# EAGLE design umoto (EAGLE 5.12)
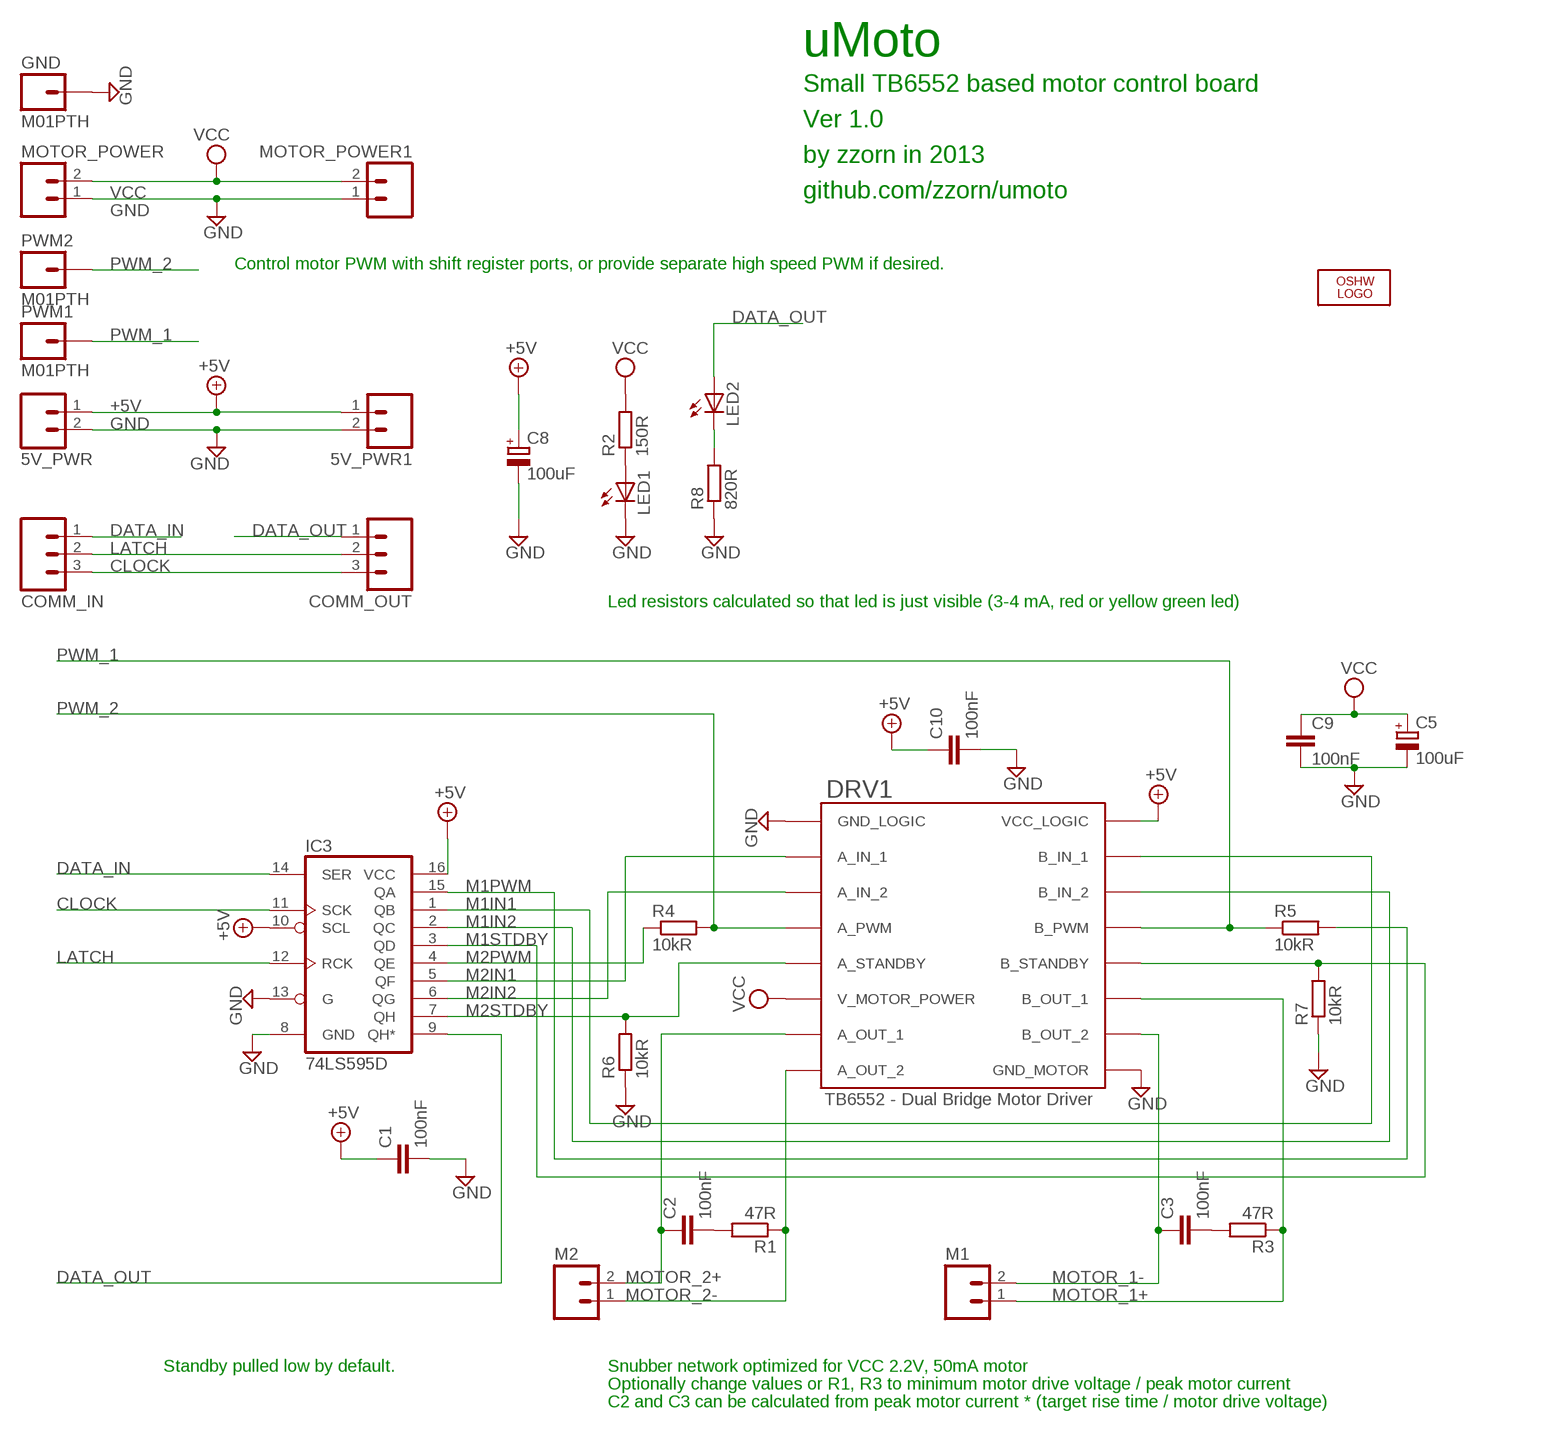
[diagram p0: schematic, sheet 1]

## Parts
5V_PWR  M02PTH  [1X02]
5V_PWR1  M02PTH  [1X02]
C1  100nF  C-EUC0805  [C0805]
C2  100nF  C-EUC0805  [C0805]
C3  100nF  C-EUC0805  [C0805]
C5  100uF  CPOL-EUE2.5-6  [E2,5-6]
C8  100uF  CPOL-EUE2.5-6  [E2,5-6]
C9  100nF  C-EUC0805  [C0805]
C10  100nF  C-EUC0805  [C0805]
COMM_IN  M03PTH  [1X03]
COMM_OUT  M03PTH  [1X03]
DRV1  TB6552FN  [SSOP16]
GND  M01PTH  [1X01]
IC3  74LS595D  [SO16]
LED1  LEDCHIPLED_0805  [CHIPLED_0805]
LED2  LEDCHIPLED_0805  [CHIPLED_0805]
LOGO1  OSHW_LOGO_6MILX0070-NT  [OSHW_6X70_NOTEXT]
M1  M02PTH  [1X02]
M2  M02PTH  [1X02]
MOTOR_POWER  M02PTH  [1X02]
MOTOR_POWER1  M02PTH  [1X02]
PWM1  M01PTH  [1X01]
PWM2  M01PTH  [1X01]
R1  47R  R-EU_R0805  [R0805]
R2  150R  R-EU_R0805  [R0805]
R3  47R  R-EU_R0805  [R0805]
R4  10kR  R-EU_R0805  [R0805]
R5  10kR  R-EU_R0805  [R0805]
R6  10kR  R-EU_R0805  [R0805]
R7  10kR  R-EU_R0805  [R0805]
R8  820R  R-EU_R0805  [R0805]

## Nets
+5V: 5V_PWR1.1 5V_PWR.1 C1.1 C8.+ C10.1 DRV1.P$16(VCC_LOGIC) IC3.10(SCL) IC3.16(VCC)
CLOCK: COMM_IN.3 COMM_OUT.3 IC3.11(SCK)
DATA_IN: COMM_IN.1 IC3.14(SER)
DATA_OUT: COMM_OUT.1 IC3.9(QH*) LED2.A
GND: 5V_PWR1.2 5V_PWR.2 C1.2 C5.- C8.- C9.2 C10.2 DRV1.P$1(GND_LOGIC) DRV1.P$9(GND_MOTOR) GND.1 IC3.8(GND) IC3.13(G) LED1.C MOTOR_POWER1.1 MOTOR_POWER.1 R6.1 R7.1 R8.1
LATCH: COMM_IN.2 COMM_OUT.2 IC3.12(RCK)
M1IN1: DRV1.P$15(B_IN_1) IC3.1(QB)
M1IN2: DRV1.P$14(B_IN_2) IC3.2(QC)
M1PWM: IC3.15(QA) R5.2
M1STDBY: DRV1.P$12(B_STANDBY) IC3.3(QD) R7.2
M2IN1: DRV1.P$2(A_IN_1) IC3.5(QF)
M2IN2: DRV1.P$3(A_IN_2) IC3.6(QG)
M2PWM: IC3.4(QE) R4.1
M2STDBY: DRV1.P$5(A_STANDBY) IC3.7(QH) R6.2
MOTOR_1+: DRV1.P$11(B_OUT_1) M1.1 R3.1
MOTOR_1-: C3.1 DRV1.P$10(B_OUT_2) M1.2
MOTOR_2+: C2.1 DRV1.P$7(A_OUT_1) M2.2
MOTOR_2-: DRV1.P$8(A_OUT_2) M2.1 R1.1
N$1: LED1.A R2.1
N$3: C2.2 R1.2
N$6: C3.2 R3.2
N$10: LED2.C R8.2
PWM_1: DRV1.P$13(B_PWM) PWM1.1 R5.1
PWM_2: DRV1.P$4(A_PWM) PWM2.1 R4.2
VCC: C5.+ C9.1 DRV1.P$6(V_MOTOR_POWER) MOTOR_POWER1.2 MOTOR_POWER.2 R2.2

## Notes on the sheet
- uMoto
- Small TB6552 based motor control board
- Ver 1.0
- by zzorn in 2013
- github.com/zzorn/umoto
- Control motor PWM with shift register ports, or provide separate high speed PWM if desired.
- Led resistors calculated so that led is just visible (3-4 mA, red or yellow green led)
- Standby pulled low by default. | Snubber network optimized for VCC 2.2V, 50mA motor
- Optionally change values or R1, R3 to minimum motor drive voltage / peak motor current
- C2 and C3 can be calculated from peak motor current * (target rise time / motor drive voltage)

## Library data of the parts
5V_PWR 5V_PWR1 M1 M2 MOTOR_POWER MOTOR_POWER1 = SparkFun:M02: Header 2 Standard 2-pin 0.1" header. Use with straight break away headers (SKU : PRT-00116), right angle break away headers (PRT-00553), swiss pins (PRT-00743), machine pins (PRT-00117), and female headers (PRT-00115). Molex polarized connector foot print use with SKU : PRT-08233 with associated crimp pins and housings.
C1-C3 C9 C10 = rcl:C-EU: CAPACITOR, European symbol
C5 C8 = rcl:CPOL-EU: POLARIZED CAPACITOR, European symbol
COMM_IN COMM_OUT = SparkFun:M03: Header 3 Standard 3-pin 0.1" header. Use with straight break away headers (SKU : PRT-00116), right angle break away headers (PRT-00553), swiss pins (PRT-00743), machine pins (PRT-00117), and female headers (PRT-00115). Molex polarized connector foot print use with SKU : PRT-08232 with associated crimp pins and housings.
DRV1 = TB6552:TB6552: DUAL-BRIDGE DRIVER IC FOR DC MOTORS The TB6552FN/FNG/FL/FLG is a dual-bridge driver IC for DC motors with output transistors in an LD MOS structure with low ON-resistance. Two input signals, IN1 and IN2, can chose one of four modes such as CW, CCW, short brake, and stop mode. A PWM drive system supports high heat efficiency driving.
GND PWM1 PWM2 = SparkFun:M01: Header 1 Standard 1-pin 0.1" header. Use with straight break away headers (SKU : PRT-00116), right angle break away headers (PRT-00553), swiss pins (PRT-00743), machine pins (PRT-00117), and female headers (PRT-00115).
IC3 = SparkFun:74*595: 8-bit SHIFT REGISTER, output latch
LED1 LED2 = led:LED: LED OSRAM: - CHIPLED LG R971, LG N971, LY N971, LG Q971, LY Q971, LO R971, LY R971 LH N974, LH R974 LS Q976, LO Q976, LY Q976 LO Q996 - Hyper CHIPLED LW Q18S LB Q993, LB Q99A, LB R99A - SideLED LS A670, LO A670, LY A670, LG A670, LP A670 LB A673, LV A673, LT A673, LW A673 LH A674 LY A675 LS A676, LA A676, LO A676, LY A676, LW A676 LS A679, LY A679, LG A679 - Hyper Micro SIDELED® LS Y876, LA Y876, LO Y876, LY Y876 LT Y87S - SmartLED LW L88C, LW L88S LB L89C, LB L89S, LG L890 LS L89K, LO L89K, LY L89K LS L896, LA L896, LO L896, LY L896 - TOPLED LS T670, LO T670, LY T670, LG T670, LP T670 LSG T670, LSP T670, LSY T670, LOP T670, LYG T670 LG T671, LOG T671, LSG T671 LB T673, LV T673, LT T673, LW T673 LH T674 LS T676, LA T676, LO T676, LY T676, LB T676, LH T676, LSB T676, LW T676 LB T67C, LV T67C, LT T67C, LS T67K, LO T67K, LY T67K, LW E67C LS E67B, LA E67B, LO E67B, LY E67B, LB E67C, LV E67C, LT E67C LW T67C LS T679, LY T679, LG T679 LS T770, LO T770, LY T770, LG T770, LP T770 LB T773, LV T773, LT T773, LW T773 LH T774 LS E675, LA E675, LY E675, LS T675 LS T776, LA T776, LO T776, LY T776, LB T776 LHGB T686 LT T68C, LB T68C - Hyper Mini TOPLED® LB M676 - Mini TOPLED Santana® LG M470 LS M47K, LO M47K, LY M47K Source: http://www.osram.convergy.de LUXEON: - LUMILED® LXK2-PW12-R00, LXK2-PW12-S00, LXK2-PW14-U00, LXK2-PW14-V00 LXK2-PM12-R00, LXK2-PM12-S00, LXK2-PM14-U00 LXK2-PE12-Q00, LXK2-PE12-R00, LXK2-PE12-S00, LXK2-PE14-T00, LXK2-PE14-U00 LXK2-PB12-K00, LXK2-PB12-L00, LXK2-PB12-M00, LXK2-PB14-N00, LXK2-PB14-P00, LXK2-PB14-Q00 LXK2-PR12-L00, LXK2-PR12-M00, LXK2-PR14-Q00, LXK2-PR14-R00 LXK2-PD12-Q00, LXK2-PD12-R00, LXK2-PD12-S00 LXK2-PH12-R00, LXK2-PH12-S00 LXK2-PL12-P00, LXK2-PL12-Q00, LXK2-PL12-R00 Source: www.luxeon.com KINGBRIGHT: KA-3528ASYC Source: www.kingbright.com
LOGO1 = ohw-logo:OSHW_LOGO_6MIL
R1-R8 = rcl:R-EU_: RESISTOR, European symbol

## Board
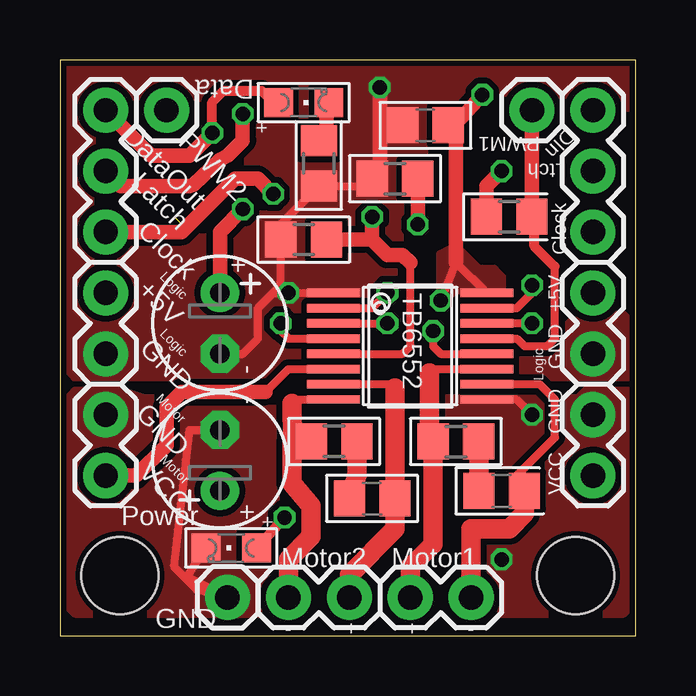
[diagram p1: board, top side]
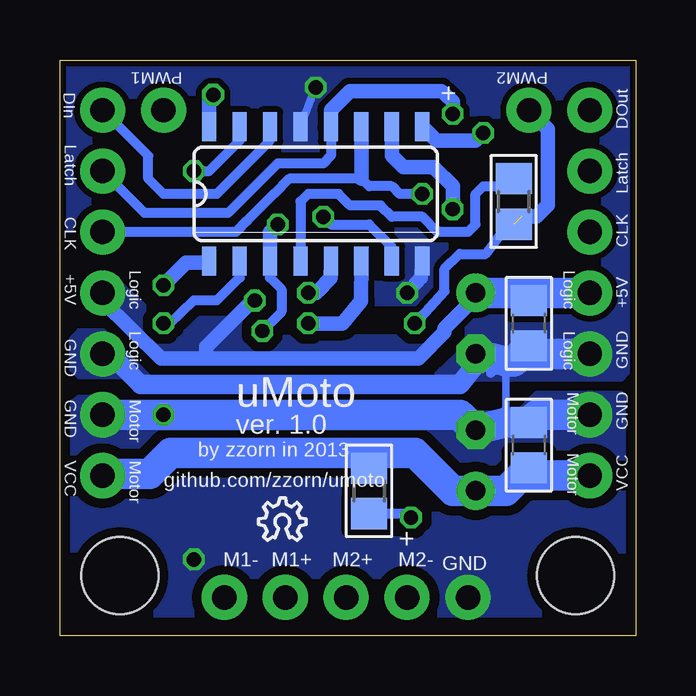
[diagram p2: board, bottom side, seen from below]

Size 24 x 24 mm. Coordinates in mm from the lower left corner, seen from the top.
Outline: 0,0 24,0 24,24 0,24 0,0
Copper layers (1*16): Top 0.035mm / dielectric 0.2mm / Bottom 0.035mm
Design rules "SeeedStudio_DRU_no_angle_20130527 *": minimum track width 6mil, minimum drill 12mil, track to track 6mil, track to pad 6mil, pad to pad 6mil, via to via 6mil, smd to smd 0mil, copper to edge 10mil, drill to drill 10mil, minimum pad ring 6mil, minimum via ring 6mil, stop-mask expansion 2mil, vias tented up to drill 25mil, thermal gap 10mil
Holes 3.2 mm at 21.5,2.5 2.5,2.5

### Footprints (pad centres in the part's own frame; a part is rotated, then mirrored left to right if it is on the bottom)
1X02 = drill 1.016 pad 1.88 round: 1 0,0; 2 2.54,0
C0805 = smd 1.3 x 1.5: 1 -0.95,0; 2 0.95,0
E2,5-6 = drill 0.813 pad 1.6 round: + -1.27,0 | drill 0.813 pad 1.6 octagon: - 1.27,0
1X03 = drill 1.016 pad 1.88 round: 1 0,0; 2 2.54,0; 3 5.08,0
SSOP16 = smd 2.2 x 0.35: P$1 -3.2,2.223; P$2 -3.2,1.587; P$3 -3.2,0.953; P$4 -3.2,0.318; P$5 -3.2,-0.318; P$6 -3.2,-0.953; P$7 -3.2,-1.587; P$8 -3.2,-2.223; P$9 3.2,-2.223; P$10 3.2,-1.587; P$11 3.2,-0.953; P$12 3.2,-0.318; P$13 3.2,0.318; P$14 3.2,0.953; P$15 3.2,1.587; P$16 3.2,2.223
1X01 = drill 1.016 pad 1.88 round: 1 0,0
SO16 = smd 0.6 x 1.2: 1 -4.445,-2.8; 2 -3.175,-2.8; 3 -1.905,-2.8; 4 -0.635,-2.8; 5 0.635,-2.8; 6 1.905,-2.8; 7 3.175,-2.8; 8 4.445,-2.8; 9 4.445,2.8; 10 3.175,2.8; 11 1.905,2.8; 12 0.635,2.8; 13 -0.635,2.8; 14 -1.905,2.8; 15 -3.175,2.8; 16 -4.445,2.8
CHIPLED_0805 = smd 1.2 x 1.2: A 0,-1.05; C 0,1.05
R0805 = smd 1.3 x 1.5: 1 -0.95,0; 2 0.95,0

### Placement (x,y rotation side)
5V_PWR  1.91,14.29 270 top
5V_PWR1  22.23,14.29 270 top
C1  4.45,13.02 270 bottom
C2  13.02,5.71 180 top
C3  18.41,6.03 180 top
C5  6.67,7.3 90 top
C8  6.67,13.02 270 top
C9  4.45,7.94 90 bottom
C10  15.24,21.27 180 top
COMM_IN  22.23,21.91 270 top
COMM_OUT  1.91,21.91 270 top
DRV1  14.61,12.06 0 top
GND  6.99,1.59 0 top
IC3  13.34,18.41 0 bottom
LED1  7.14,3.65 90 top
LED2  10.16,22.23 270 top
LOGO1  15.72,3.97 0 bottom
M1  14.61,1.59 0 top
M2  9.53,1.59 0 top
MOTOR_POWER  1.91,9.21 270 top
MOTOR_POWER1  22.23,9.21 270 top
PWM1  19.68,21.91 0 top
PWM2  4.45,21.91 0 top
R1  11.43,8.1 0 top
R2  11.11,6.03 90 bottom
R3  16.51,8.09 0 top
R4  5.08,18.1 270 bottom
R5  18.73,17.46 180 top
R6  10.16,16.51 0 top
R7  13.97,19.05 0 top
R8  10.79,19.68 90 top

### Tracks (layer width: path | path; a pad name or v marks a point on that pad's centre or on a via)
+5V  (via drill 0.6)
  Top 0.343: DRV1.P$16 16.51,15.56 v15.88,13.97 | C10.1 16.26,21.37 16.52,21.37
  Top 0.61: v7.62,17.78 6.67,16.83 C8.+ | v17.61,22.55 16.52,21.37 16.51,21.1 16.51,15.56
  Bottom 0.406: 17.76,22.3 17.78,22.28
  Bottom 0.61: 6.71,14.21 6.71,14.05 7.96,12.8 7.96,12.65 9.05,11.56 17.92,11.56 | 17.92,11.56 19.78,11.56 22.21,13.96 5V_PWR1.1 | 17.92,11.56 17.92,12.03 15.97,13.97 v15.88,13.97 | IC3.10 10.16,20 9.69,19.53 8.42,19.53 7.62,18.73 v7.62,17.78 | v17.61,22.55 17.76,22.3 | 17.78,22.28 IC3.16
  Bottom 0.813: C8.+ 6.71,14.21 | 6.71,14.21
  Bottom 1.27: 5V_PWR.1 4.44,14.29 C1.1 4.48,14.28 C8.+
  pour Top (isolate 0.406, no thermals): 18.41,14.61 18.41,14.92 18.1,15.24 17.46,15.24 16.51,16.19 15.88,15.88 15.88,14.29 16.19,14.29
  pour Bottom (isolate 0.406, no thermals): 9.2,11.56 9.05,11.72 8.43,12.34 14.65,12.34 16.52,12.34 16.52,13.12 19.94,13.12 21.96,14.98 22.12,13.74 20.09,11.87 19.63,11.56
CLOCK  (via drill 0.6)
  Top 0.61: v8.89,18.41 8.26,19.05 7.3,19.05 5.08,16.83 COMM_OUT.3
  Bottom 0.406: v8.89,18.41 9.84,18.41 10.16,18.73 11.11,18.73 11.43,19.05 14.44,19.05 15.08,18.41 16.19,17.31 16.19,17.3 16.67,16.83 COMM_IN.3
  Bottom 0.61: 11.43,19.05 IC3.11
DATA_IN
  Bottom 0.406: COMM_IN.1 20.32,20 20.32,19.05 19.68,18.41 17.46,18.41 15.24,20.64 IC3.14
DATA_OUT  (via drill 0.6)
  Top 0.406: LED2.A 8.8,22.32 8.41,22.71 6.82,22.71 6.35,22.24 v6.35,20.95
  Top 0.61: COMM_OUT.1 3.81,20 5.4,20 v6.35,20.95
  Bottom 0.61: v6.35,20.95 6.67,20.64 8.31,20.64 IC3.9
GND  (via drill 0.6)
  Top 0.305: v9.53,14.29 DRV1.P$1
  Top 0.343: 10.79,18.41 11.43,18.73 12.38,18.73 R7.1 13.34,19.05 | 8.89,14.29 v9.53,14.29 | 8.89,14.29 8.26,13.65 8.26,12.38 7.62,11.75 C8.- | 8.89,14.29 9.21,14.61 R6.1 9.21,17.14 10.48,18.41 10.79,18.41 | DRV1.P$9 19.05,9.84 v19.68,9.21 | C5.- 5.4,8.57 4.76,2.86 5.71,1.91 GND.1 5.3,2.44 LED1.C | 10.79,18.41 R8.1
  Top 0.61: 13.34,19.05 13.34,21.27 | 13.34,21.27 v13.34,22.86 | 13.34,21.27 C10.2
  Bottom 0.305: 5.4,8.89 5.4,11.43
  Bottom 0.343: v13.34,22.86 IC3.13
  Bottom 0.381: 5.98,10.98 6.03,10.93
  Bottom 0.61: 21.91,11.75 5V_PWR1.2 | IC3.8 8.95,14.92 v9.53,14.29
  Bottom 0.813: 21.91,11.75 20.64,10.48 7.33,10.48 6.68,11.28 C8.-
  Bottom 1.27: MOTOR_POWER1.1 v19.68,9.21 7.32,9.21 C5.- 5.4,8.89 C9.2 4.12,9.21 MOTOR_POWER.1 | 5V_PWR.2 4.12,11.75 C1.2 5.08,11.43 5.4,11.43 C8.-
  other vias: 18.41,3.17
  pour Bottom (isolate 0.254, no thermals): 0.64,24.45 23.5,24.45 24.45,23.81 24.45,17.46 22.86,16.46 16.84,16.65 14.45,13.95 7.56,13.95 6.92,13.32 6.93,12.06 8.26,10.79 0.64,10.79 -0.32,11.75 -0.32,23.18
  pour Top (isolate 0.254, no thermals): 0.64,10.79 -0.32,11.75 -0.32,23.18 0.32,24.13 23.18,24.13 23.81,23.5 24.13,22.54 20.32,18.41 19.68,17.78 15.56,17.78 14.61,16.83 14.61,14.92 13.97,14.29 13.97,12.7 14.61,12.06 20.32,12.06 21.59,13.34 23.5,13.34 24.45,12.38 24.45,11.43 23.81,10.79
  pour Top (isolate 0.254, no thermals): 0.64,10.16 -0.32,9.21 -0.32,1.91 0.64,0.95 23.5,0.95 24.45,1.91 24.45,9.53 23.81,10.16 21.91,10.16 21.59,9.84 3.49,9.84 2.54,10.16
  pour Bottom (isolate 0.406, no thermals): 0.64,10 -0.32,9.05 -0.32,1.91 0.64,0.95 23.5,0.95 24.45,1.91 24.45,8.89 23.18,9.84 21.91,9.84 20.95,9.21 4.88,9.21 4.1,10
  pour Bottom (isolate 0.254, no thermals): 20.32,10.79 23.18,10.79 23.5,11.11 23.5,12.38 23.18,12.7 22.23,12.7
LATCH  (via drill 0.6)
  Top 0.61: v7.62,21.75 7.62,20.64 6.99,20 6.67,19.84 5.57,18.81 5.41,18.74 2.53,18.74 COMM_OUT.2
  Bottom 0.343: COMM_IN.2
  Bottom 0.406: IC3.12 12.7,20 13.02,19.68 14.92,19.68 16.99,17.62 20.47,17.62 COMM_IN.2
  Bottom 0.61: v7.62,21.75 7.62,22.27 7.65,22.3 8.1,22.7 11.9,22.7 12.7,21.91 IC3.12
M1IN1  (via drill 0.6)
  Top 0.343: DRV1.P$15 19.05,13.65 19.68,14.29 v19.68,14.61
  Bottom 0.61: v19.68,14.61 18.73,15.56 17.78,15.56 IC3.1
M1IN2  (via drill 0.6)
  Top 0.343: v19.68,13.02 DRV1.P$14
  Bottom 0.406: v19.68,13.02 19.53,13.02 19.47,12.96 18.42,13.97 17.46,13.97 16.51,14.92 IC3.2
M1PWM  (via drill 0.6)
  Top 0.61: R5.2 17.78,18.73 v18.41,19.37
  Bottom 0.406: IC3.15 16.51,20.64 17.78,19.37 v18.41,19.37
M1STDBY  (via drill 0.6)
  Top 0.343: DRV1.P$12 15.88,11.75 15.56,12.06 v15.56,12.7
  Top 0.61: v14.92,17.14 14.93,18.73 R7.2
  Bottom 0.406: v15.56,12.7 14.76,13.5 14.76,14.44 15.24,14.92 IC3.3
  Bottom 0.61: IC3.3 15.24,16.83 v14.92,17.14
M2IN1  (via drill 0.6)
  Top 0.343: DRV1.P$2 13.02,13.65 v13.65,14.29
  Bottom 0.406: 13.32,14.29 13.25,14.36
  Bottom 0.61: v13.65,14.29 13.32,14.29 | 13.25,14.36 12.71,14.92 IC3.5
M2IN2  (via drill 0.6)
  Top 0.343: DRV1.P$3 v13.65,13.02
  Bottom 0.61: v13.65,13.02 12.23,13.02 11.44,13.96 IC3.6
M2PWM
  Bottom 0.406: IC3.4 13.97,18.1 13.65,18.41 12.38,18.41 11.9,17.94 10.63,17.94 10.16,17.46 8.89,17.46 8.26,16.83 6.99,16.83 6.67,17.14 6.67,18.41 6.35,18.73 5.72,18.73 R4.1
M2STDBY  (via drill 0.6)
  Top 0.343: DRV1.P$5 14.29,11.75 14.61,12.06 14.61,15.56
  Top 0.61: 14.61,15.56 14.29,15.88 13.65,15.88 13.02,16.51 | 13.02,16.51 R6.2 | 13.02,16.51 v13.02,17.46
  Bottom 0.406: IC3.7 10.16,16.19 11.11,17.14 12.7,17.14 v13.02,17.46
MOTOR_1+
  Top 0.343: DRV1.P$11 15.24,11.11 15.4,10.95
  Top 0.813: M1.1 14.61,2.86 15.55,3.81 15.55,7.94 | 15.55,7.94 R3.1 | 15.55,7.94 15.4,8.26 15.4,10.95
MOTOR_1-
  Top 0.343: DRV1.P$10 20,10.48 20.64,9.84 20.64,8.26 19.05,6.67 19.37,5.56
  Top 0.813: M1.2 17.14,4.45 18.73,4.45 19.37,5.1 19.37,5.56 | 19.37,5.56 19.37,5.55 | 19.37,5.56 C3.1
MOTOR_2+
  Top 0.343: 13.97,10.32 13.65,10.48 DRV1.P$7
  Top 0.813: M2.2 12.06,2.54 13.97,4.45 13.96,5.44 C2.1 13.97,6.35 13.97,6.67 13.97,10.32
MOTOR_2-
  Top 0.343: DRV1.P$8 9.7,9.84 9.68,9.68
  Top 0.813: M2.1 9.53,3.17 10.48,4.13 10.48,5.4 9.68,6.35 9.68,8.07 R1.1 9.69,8.12 9.68,9.68
N$1  (via drill 0.6)
  Top 0.406: LED1.A v9.37,4.92
  Bottom 0.406: v9.37,4.92 9.68,5.08 R2.1
N$3
  Top 0.813: C2.2 12.39,6.67 12.39,7.62 R1.2
N$6
  Top 0.813: C3.2 17.46,7.62 R3.2
N$10
  Top 0.343: R8.2 10.91,20.75
  Top 0.61: 10.91,20.75 11.11,20.95 11.11,21.91 LED2.C
PWM_1
  Top 0.343: DRV1.P$13 19.05,12.38 19.37,12.06 20.32,12.06 20.64,12.38 20.64,15.4 20.61,15.4 | 19.78,17.32 R5.1
  Top 0.406: 20.61,15.4 19.78,16.23 19.78,17.32
  Top 0.61: PWM1.1 R5.1
PWM_2  (via drill 0.6)  (1 unrouted)
  Top 0.343: DRV1.P$4 9.53,12.38 9.21,12.7 v9.21,13.02
  Bottom 0.343: R4.2 5.4,16.83
  Bottom 0.406: v9.21,13.02 7.96,14.36 7.96,15.29 7.34,15.92 6.25,15.92 5.56,16.82 R4.2
  Bottom 0.61: PWM2.1 3.65,21.11 3.65,17.94 4.13,17.46 4.76,17.46
VCC
  Top 0.33: DRV1.P$6 9.53,11.11 8.57,10.16
  Top 0.61: 8.57,10.16 5.08,10.16 4.45,9.53 4.45,7.94 3.17,6.67 MOTOR_POWER.2
  Bottom 0.406: 11.11,7.62 R2.2
  Bottom 1.27: MOTOR_POWER1.2 22.12,6.74 20.25,6.74 19.39,7.62 11.11,7.62 9.21,7.62 7.62,6.03 C5.+ 5.4,6.03 C9.1 4.44,6.67 MOTOR_POWER.2

### Text on the board
_tsilk: Data | DataOut | PWM2 | + | PWM1 | DIn | Ltch | Latch | Clock | + | Clock | Logic | +5V | TB6552 | Logic | +5V | GND | - | Logic | GND | Motor | - | GND | GND | VCC | Motor | VCC | Power | + | + | Motor2 | Motor1 | GND | - | + | + | -
_bsilk: PWM2 | PWM1 | DIn | + | DOut | Latch | Latch | CLK | CLK | Logic | Logic | +5V | +5V | Logic | Logic | GND | GND | Motor | uMoto | Motor | GND | GND | Motor | ver. 1.0 | by zzorn in 2013 | Motor | VCC | VCC | github.com/zzorn/umoto | + | GND | M2- | M2+ | M1+ | M1-